# EAGLE design ft-joy (EAGLE 6.6.0)
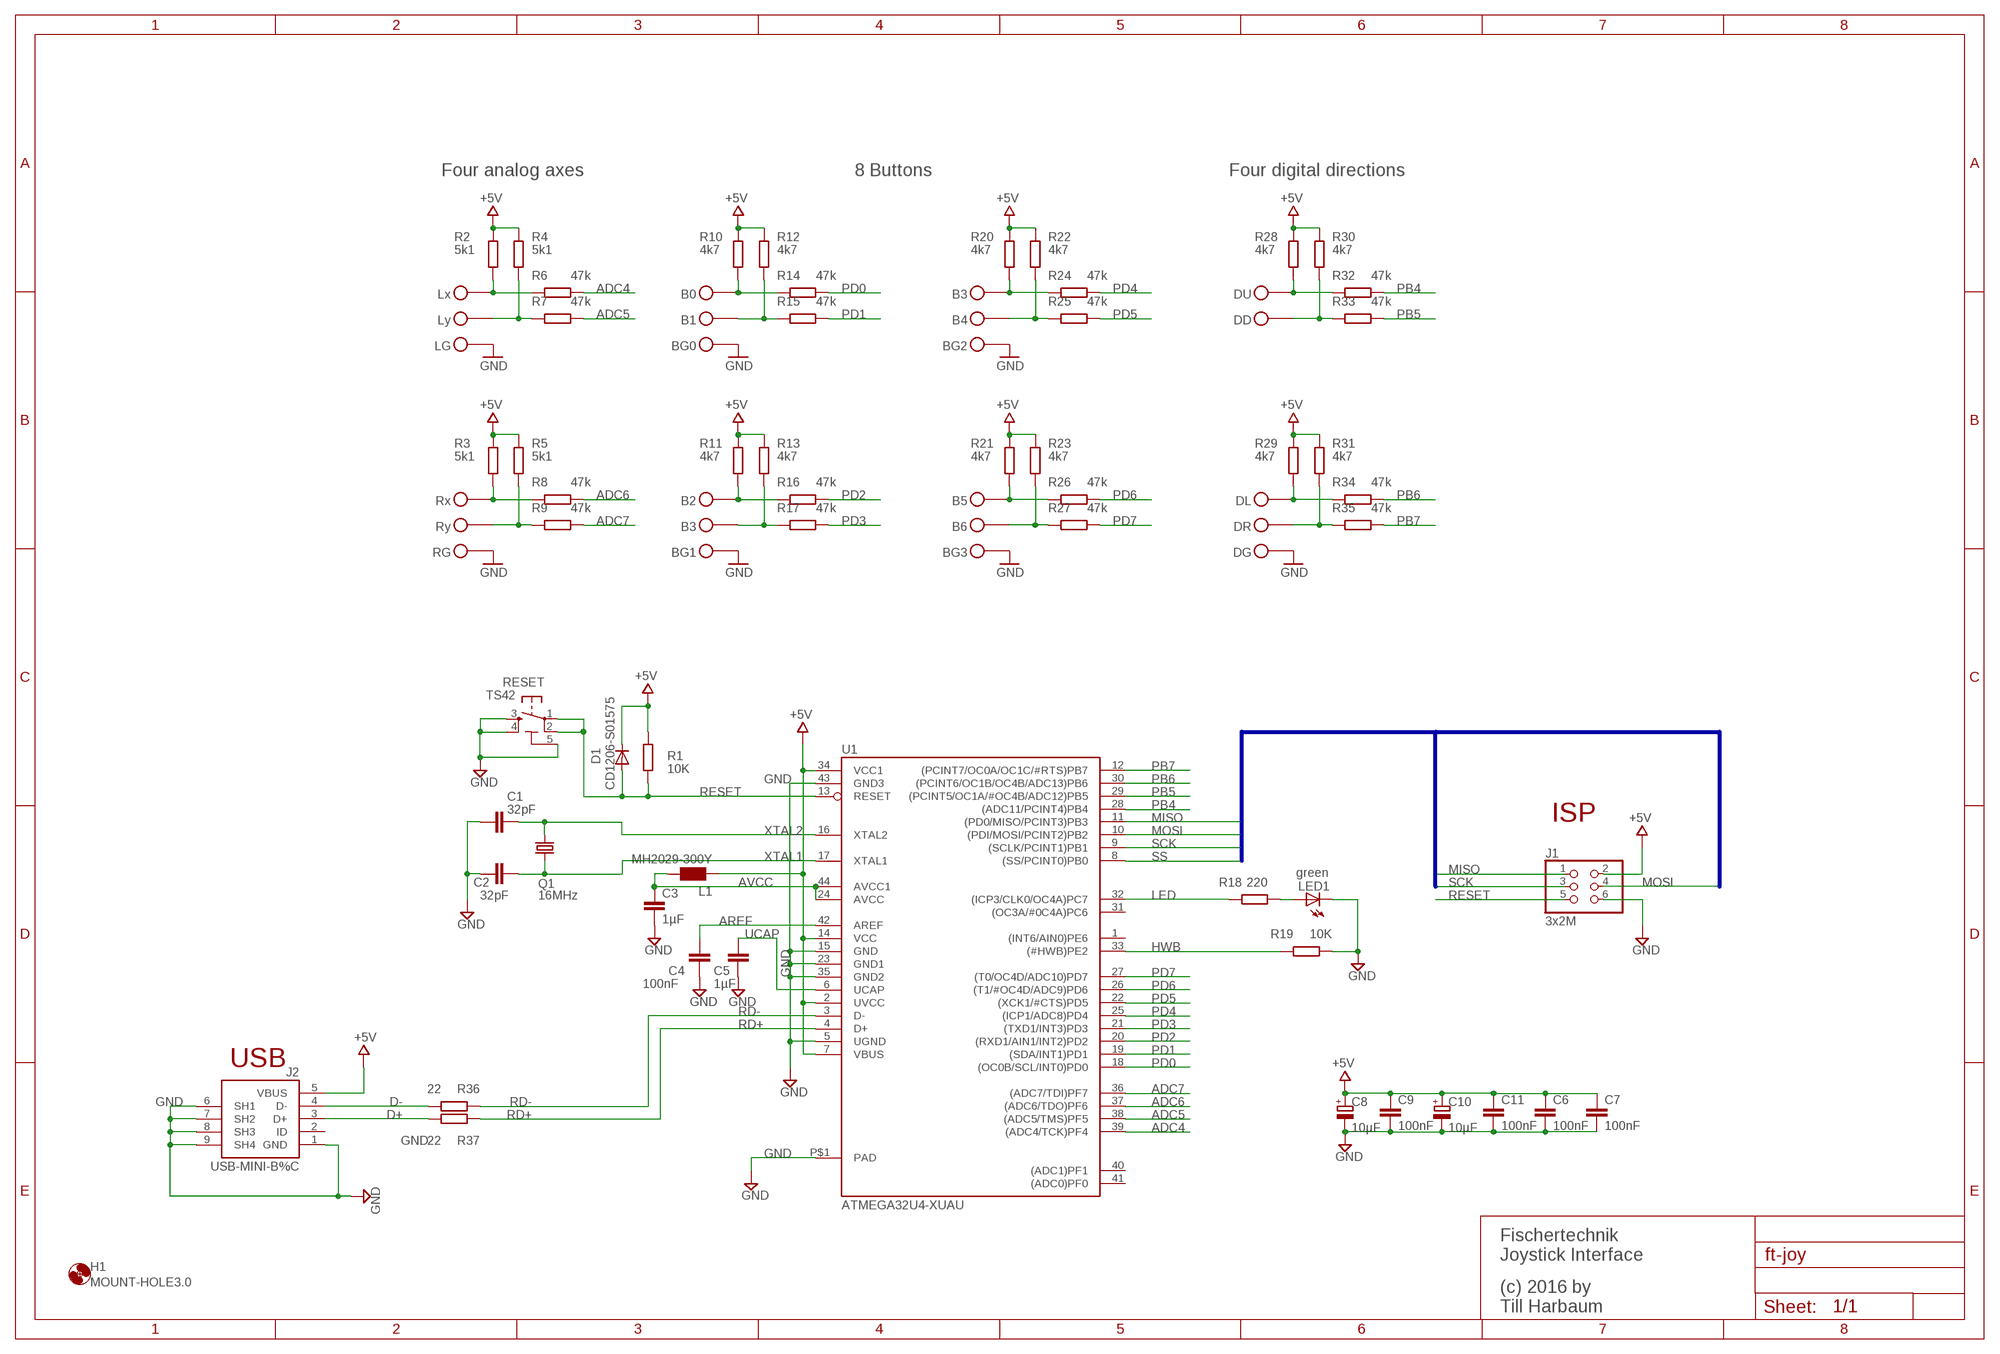
[diagram p0: schematic, sheet 1]

## Parts
C1  32pF  C-EUC0805  [C0805]
C2  32pF  C-EUC0805  [C0805]
C3  1µF  C-EUC0805  [C0805]
C4  100nF  C-EUC0805  [C0805]
C5  1µF  C-EUC0805  [C0805]
C6  100nF  C-EUC0805  [C0805]
C7  100nF  C-EUC0805  [C0805]
C8  10µF  CPOL-EUSMCB  [SMC_B]
C9  100nF  C-EUC0805  [C0805]
C10  10µF  CPOL-EUSMCB  [SMC_B]
C11  100nF  C-EUC0805  [C0805]
D1  CD1206-S01575  DIODE-MINIMELF  [MINIMELF]
H1  MOUNT-HOLE3.0  [3,0]
J1  3x2M  PINHD-2X3  [2X03]
J2  USB-MINI-B%C  [USB-MINI-B_2]
L1  MH2029-300Y  WE-CBF_0805  [0805]
LED1  green  LEDCHIPLED_0805  [CHIPLED_0805]
P1  Lx  FT-HUELSE  [FT-HUELSE]
P2  Ly  FT-HUELSE  [FT-HUELSE]
P3  LG  FT-HUELSE  [FT-HUELSE]
P4  Rx  FT-HUELSE  [FT-HUELSE]
P5  Ry  FT-HUELSE  [FT-HUELSE]
P6  RG  FT-HUELSE  [FT-HUELSE]
P7  B0  FT-HUELSE  [FT-HUELSE]
P8  B1  FT-HUELSE  [FT-HUELSE]
P9  BG0  FT-HUELSE  [FT-HUELSE]
P10  B2  FT-HUELSE  [FT-HUELSE]
P11  B3  FT-HUELSE  [FT-HUELSE]
P12  BG1  FT-HUELSE  [FT-HUELSE]
P13  B3  FT-HUELSE  [FT-HUELSE]
P14  B4  FT-HUELSE  [FT-HUELSE]
P15  BG2  FT-HUELSE  [FT-HUELSE]
P16  B5  FT-HUELSE  [FT-HUELSE]
P17  B6  FT-HUELSE  [FT-HUELSE]
P18  BG3  FT-HUELSE  [FT-HUELSE]
P19  DU  FT-HUELSE  [FT-HUELSE]
P20  DD  FT-HUELSE  [FT-HUELSE]
P21  DL  FT-HUELSE  [FT-HUELSE]
P22  DR  FT-HUELSE  [FT-HUELSE]
P23  DG  FT-HUELSE  [FT-HUELSE]
Q1  16MHz  CRYSTALHC49UP  [HC49UP]
R1  10K  R-EU_R0805  [R0805]
R2  5k1  R-EU_M0805  [M0805]
R3  5k1  R-EU_M0805  [M0805]
R4  5k1  R-EU_M0805  [M0805]
R5  5k1  R-EU_M0805  [M0805]
R6  47k  R-EU_M0805  [M0805]
R7  47k  R-EU_M0805  [M0805]
R8  47k  R-EU_M0805  [M0805]
R9  47k  R-EU_M0805  [M0805]
R10  4k7  R-EU_M0805  [M0805]
R11  4k7  R-EU_M0805  [M0805]
R12  4k7  R-EU_M0805  [M0805]
R13  4k7  R-EU_M0805  [M0805]
R14  47k  R-EU_M0805  [M0805]
R15  47k  R-EU_M0805  [M0805]
R16  47k  R-EU_M0805  [M0805]
R17  47k  R-EU_M0805  [M0805]
R18  220  R-EU_R0805  [R0805]
R19  10K  R-EU_R0805  [R0805]
R20  4k7  R-EU_M0805  [M0805]
R21  4k7  R-EU_M0805  [M0805]
R22  4k7  R-EU_M0805  [M0805]
R23  4k7  R-EU_M0805  [M0805]
R24  47k  R-EU_M0805  [M0805]
R25  47k  R-EU_M0805  [M0805]
R26  47k  R-EU_M0805  [M0805]
R27  47k  R-EU_M0805  [M0805]
R28  4k7  R-EU_M0805  [M0805]
R29  4k7  R-EU_M0805  [M0805]
R30  4k7  R-EU_M0805  [M0805]
R31  4k7  R-EU_M0805  [M0805]
R32  47k  R-EU_M0805  [M0805]
R33  47k  R-EU_M0805  [M0805]
R34  47k  R-EU_M0805  [M0805]
R35  47k  R-EU_M0805  [M0805]
R36  22  R-EU_M0805  [M0805]
R37  22  R-EU_M0805  [M0805]
RESET  TS42  [TS42]
U1  ATMEGA32U4-XUAU  [TQFP44-PAD]

## Nets
+5V: C6.1 C7.1 C8.+ C9.1 C10.+ C11.1 D1.C J1.2 J2.5(VBUS) L1.1 R1.1 R2.1 R3.1 R4.1 R5.1 R10.1 R11.1 R12.1 R13.1 R20.1 R21.1 R22.1 R23.1 R28.1 R29.1 R30.1 R31.1 U1.2(UVCC) U1.7(VBUS) U1.14(VCC) U1.34(VCC1)
ADC4: R6.1 U1.39((ADC4/TCK)PF4)
ADC5: R7.1 U1.38((ADC5/TMS)PF5)
ADC6: R8.1 U1.37((ADC6/TDO)PF6)
ADC7: R9.1 U1.36((ADC7/TDI)PF7)
AREF: C4.1 U1.42(AREF)
AVCC: C3.1 L1.2 U1.24(AVCC) U1.44(AVCC1)
D+: J2.3(D+) R37.1
D-: J2.4(D-) R36.1
GND: C1.1 C2.1 C3.2 C4.2 C5.2 C6.2 C7.2 C8.- C9.2 C10.- C11.2 J1.6 J2.1(GND) J2.6(SH1) J2.7(SH2) J2.8(SH3) J2.9(SH4) LED1.C P3.D1 P6.D1 P9.D1 P12.D1 P15.D1 P18.D1 P23.D1 R19.2 RESET.3 RESET.4 RESET.5(5-GND) U1.5(UGND) U1.15(GND) U1.23(GND1) U1.35(GND2) U1.43(GND3) U1.P$1(PAD)
HWB: R19.1 U1.33((#HWB)PE2)
LED: R18.1 U1.32((ICP3/CLK0/OC4A)PC7)
MISO: J1.1 U1.11((PD0/MISO/PCINT3)PB3)
MOSI: J1.4 U1.10((PDI/MOSI/PCINT2)PB2)
N$1: P2.D1 R4.2 R7.2
N$2: P4.D1 R3.2 R8.2
N$3: P5.D1 R5.2 R9.2
N$4: P7.D1 R10.2 R14.2
N$5: P8.D1 R12.2 R15.2
N$6: P10.D1 R11.2 R16.2
N$7: LED1.A R18.2
N$8: P11.D1 R13.2 R17.2
N$9: P13.D1 R20.2 R24.2
N$10: P14.D1 R22.2 R25.2
N$11: P16.D1 R21.2 R26.2
N$12: P17.D1 R23.2 R27.2
N$13: P19.D1 R28.2 R32.2
N$14: P20.D1 R30.2 R33.2
N$15: P21.D1 R29.2 R34.2
N$16: P22.D1 R31.2 R35.2
N$33: P1.D1 R2.2 R6.2
PB4: R32.1 U1.28((ADC11/PCINT4)PB4)
PB5: R33.1 U1.29((PCINT5/OC1A/#OC4B/ADC12)PB5)
PB6: R34.1 U1.30((PCINT6/OC1B/OC4B/ADC13)PB6)
PB7: R35.1 U1.12((PCINT7/OC0A/OC1C/#RTS)PB7)
PD0: R14.1 U1.18((OC0B/SCL/INT0)PD0)
PD1: R15.1 U1.19((SDA/INT1)PD1)
PD2: R16.1 U1.20((RXD1/AIN1/INT2)PD2)
PD3: R17.1 U1.21((TXD1/INT3)PD3)
PD4: R24.1 U1.25((ICP1/ADC8)PD4)
PD5: R25.1 U1.22((XCK1/#CTS)PD5)
PD6: R26.1 U1.26((T1/#OC4D/ADC9)PD6)
PD7: R27.1 U1.27((T0/OC4D/ADC10)PD7)
RD+: R37.2 U1.4(D+)
RD-: R36.2 U1.3(D-)
RESET: D1.A J1.5 R1.2 RESET.1 RESET.2 U1.13(RESET)
SCK: J1.3 U1.9((SCLK/PCINT1)PB1)
SS: U1.8((SS/PCINT0)PB0)
UCAP: C5.1 U1.6(UCAP)
XTAL1: C2.2 Q1.2 U1.17(XTAL1)
XTAL2: C1.2 Q1.1 U1.16(XTAL2)
Unconnected: J2.2(ID) U1.1((INT6/AIN0)PE6) U1.31((OC3A/#0C4A)PC6) U1.40((ADC1)PF1) U1.41((ADC0)PF0)

## Buses
B$1

## Notes on the sheet
- Four analog axes | 8 Buttons | Four digital directions
- ISP
- USB
- Fischertechnik
  Joystick Interface
- (c) 2016 by
  Till Harbaum

## Library data of the parts
C1-C7 C9 C11 = SmartPrj:C-EU: CAPACITOR, European symbol
C8 C10 = rcl:CPOL-EU: POLARIZED CAPACITOR, European symbol
D1 = diode:DIODE-: DIODE
H1 = holes:MOUNT-HOLE: MOUNTING HOLE with drill center marker
J1 = SmartPrj:PINHD-2X3: PIN HEADER
J2 = MyCON2:USB-MINI-B
L1 = wuerth-elektronik:WE-CBF: SMD EMI Suppression Ferrite Beads - excellent anti-EMI properties - low DCR - impedances till 3000 ohms - rated current up to 6 A
LED1 = led:LED: LED OSRAM: - CHIPLED LG R971, LG N971, LY N971, LG Q971, LY Q971, LO R971, LY R971 LH N974, LH R974 LS Q976, LO Q976, LY Q976 LO Q996 - Hyper CHIPLED LW Q18S LB Q993, LB Q99A, LB R99A - SideLED LS A670, LO A670, LY A670, LG A670, LP A670 LB A673, LV A673, LT A673, LW A673 LH A674 LY A675 LS A676, LA A676, LO A676, LY A676, LW A676 LS A679, LY A679, LG A679 - Hyper Micro SIDELED® LS Y876, LA Y876, LO Y876, LY Y876 LT Y87S - SmartLED LW L88C, LW L88S LB L89C, LB L89S, LG L890 LS L89K, LO L89K, LY L89K LS L896, LA L896, LO L896, LY L896 - TOPLED LS T670, LO T670, LY T670, LG T670, LP T670 LSG T670, LSP T670, LSY T670, LOP T670, LYG T670 LG T671, LOG T671, LSG T671 LB T673, LV T673, LT T673, LW T673 LH T674 LS T676, LA T676, LO T676, LY T676, LB T676, LH T676, LSB T676, LW T676 LB T67C, LV T67C, LT T67C, LS T67K, LO T67K, LY T67K, LW E67C LS E67B, LA E67B, LO E67B, LY E67B, LB E67C, LV E67C, LT E67C LW T67C LS T679, LY T679, LG T679 LS T770, LO T770, LY T770, LG T770, LP T770 LB T773, LV T773, LT T773, LW T773 LH T774 LS E675, LA E675, LY E675, LS T675 LS T776, LA T776, LO T776, LY T776, LB T776 LHGB T686 LT T68C, LB T68C - Hyper Mini TOPLED® LB M676 - Mini TOPLED Santana® LG M470 LS M47K, LO M47K, LY M47K Source: http://www.osram.convergy.de LUXEON: - LUMILED® LXK2-PW12-R00, LXK2-PW12-S00, LXK2-PW14-U00, LXK2-PW14-V00 LXK2-PM12-R00, LXK2-PM12-S00, LXK2-PM14-U00 LXK2-PE12-Q00, LXK2-PE12-R00, LXK2-PE12-S00, LXK2-PE14-T00, LXK2-PE14-U00 LXK2-PB12-K00, LXK2-PB12-L00, LXK2-PB12-M00, LXK2-PB14-N00, LXK2-PB14-P00, LXK2-PB14-Q00 LXK2-PR12-L00, LXK2-PR12-M00, LXK2-PR14-Q00, LXK2-PR14-R00 LXK2-PD12-Q00, LXK2-PD12-R00, LXK2-PD12-S00 LXK2-PH12-R00, LXK2-PH12-S00 LXK2-PL12-P00, LXK2-PL12-Q00, LXK2-PL12-R00 Source: www.luxeon.com KINGBRIGHT: KA-3528ASYC Source: www.kingbright.com
P1-P23 = ft-huelse:FT-HUELSE
Q1 = crystal:CRYSTAL: CRYSTAL; OC_FARNELL: unknown; OC_NEWARK: unknown
R1 R18 R19 = SmartPrj:R-EU_: RESISTOR, European symbol
R2-R17 R20-R37 = resistor:R-EU_: RESISTOR, European symbol
RESET = SmartPrj:TS42: TS42 Dongnan Electronics Tact switch VDC 12V - 50mA
U1 = SmartPrj:ATMEGA32U4-XU

## Net classes
0 default: width 0.254 mm, drill 0.508 mm, clearance 0.203 mm

## Board
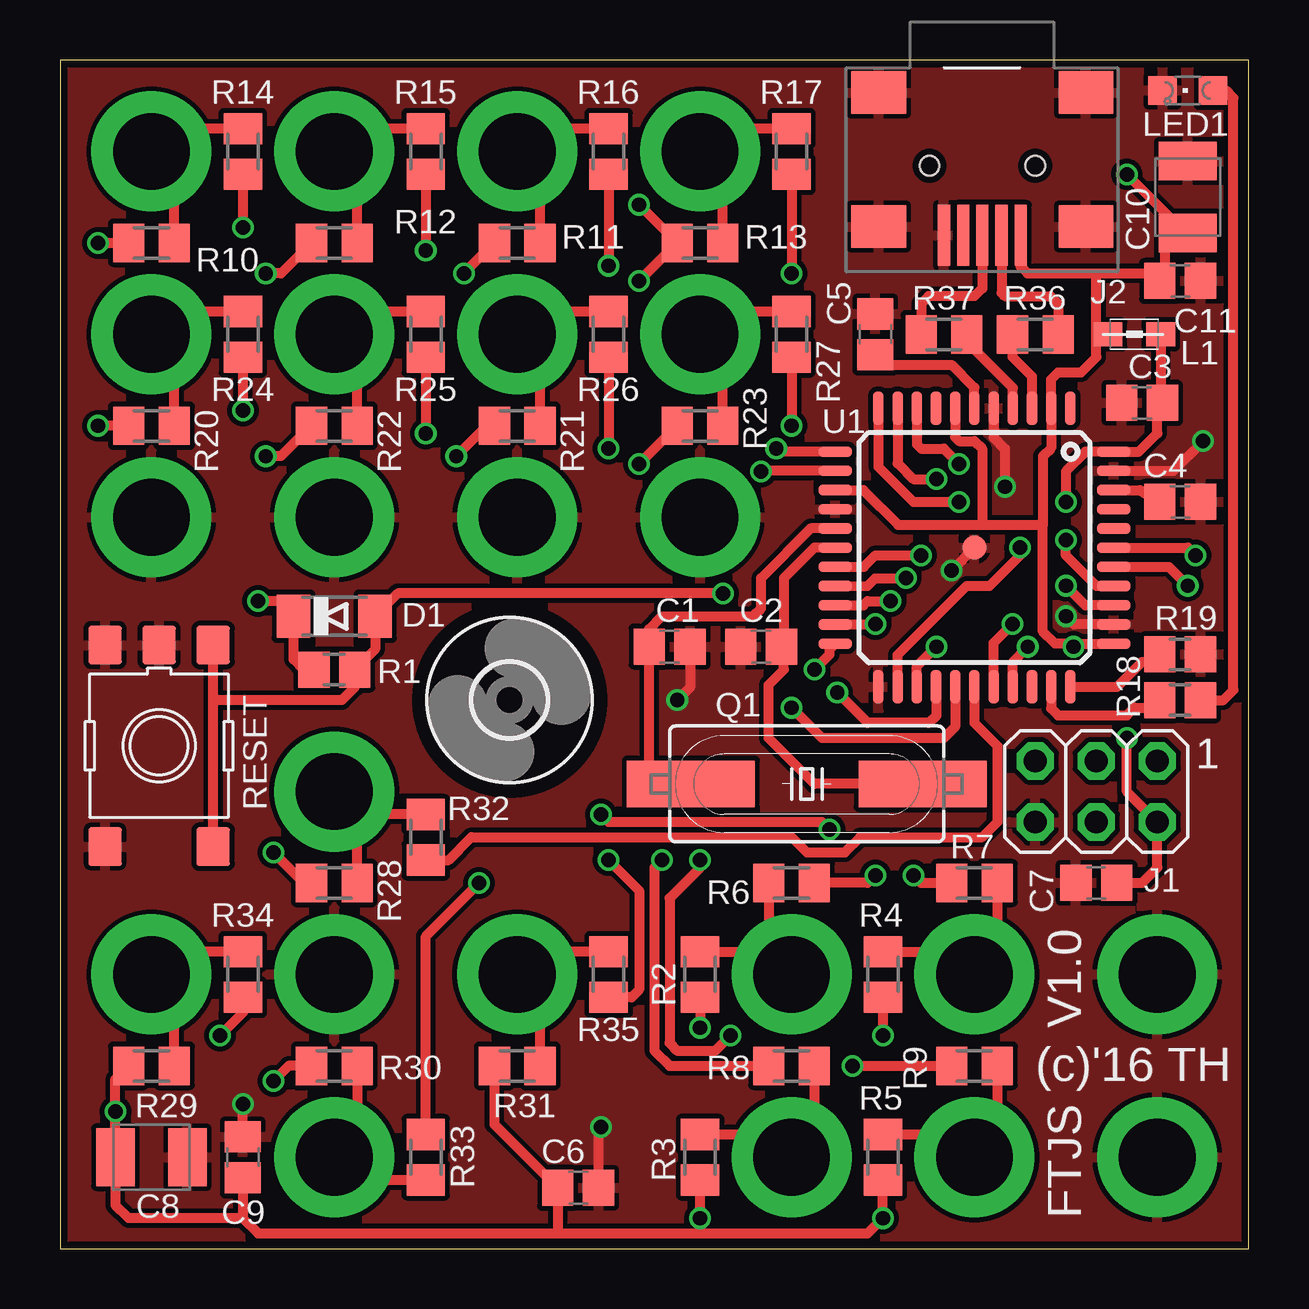
[diagram p1: board, top side]
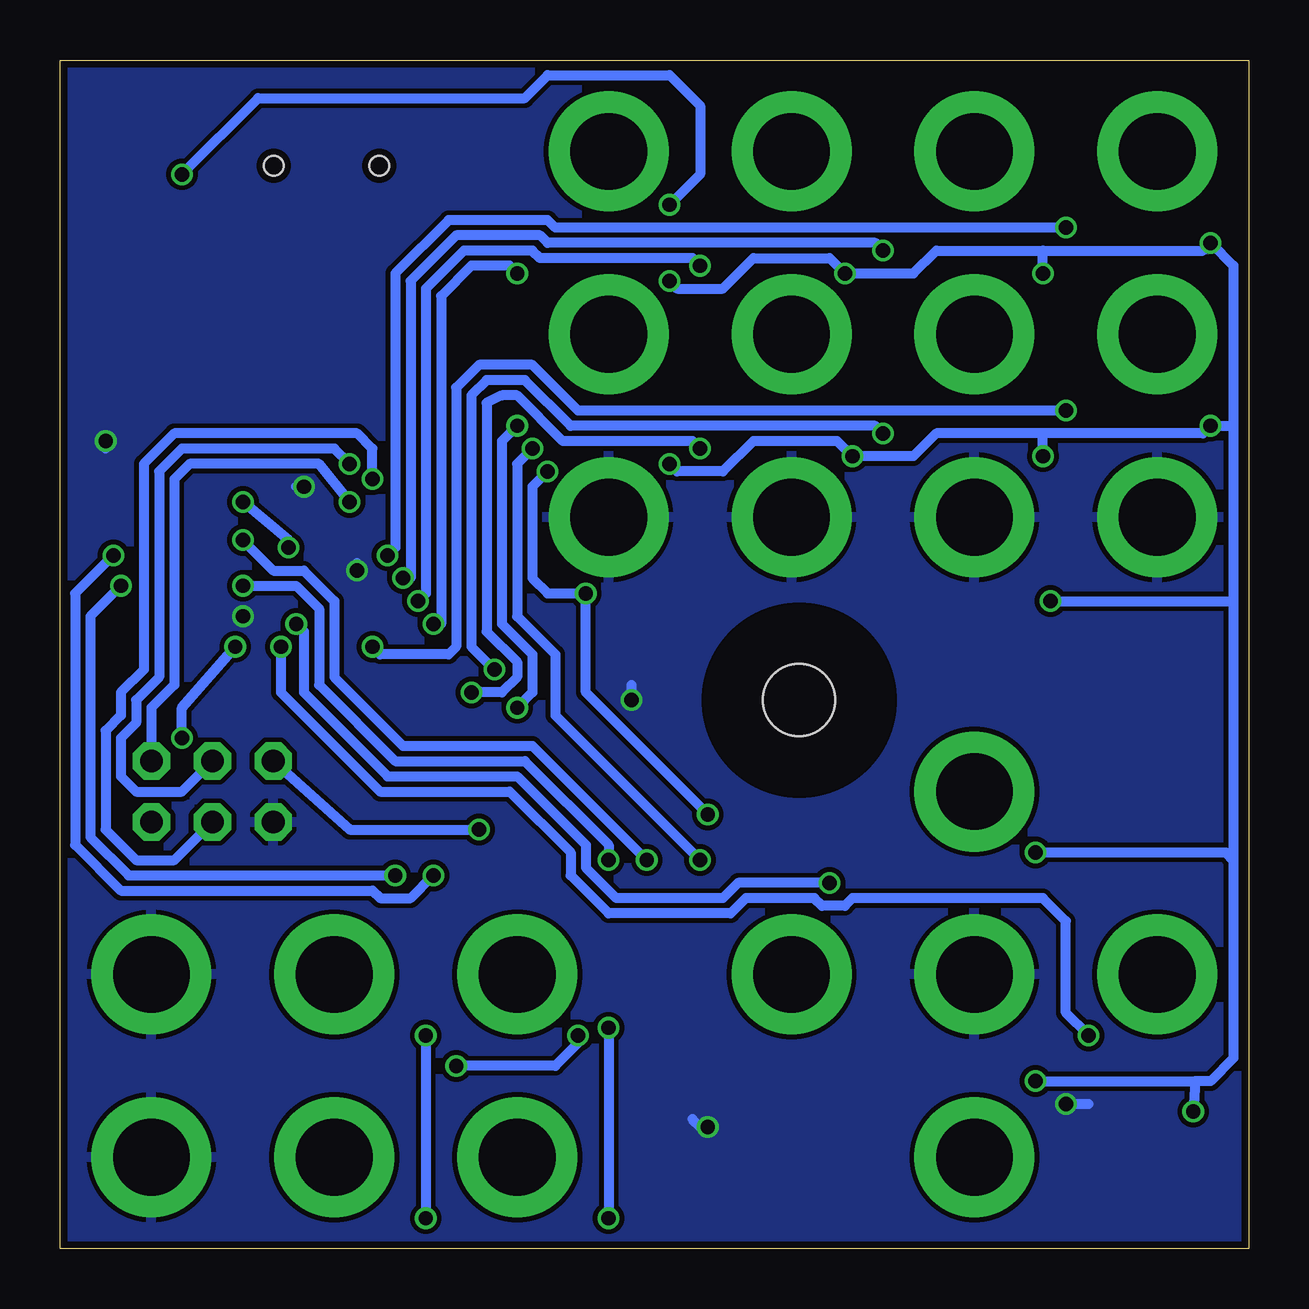
[diagram p2: board, bottom side, seen from below]

Size 49.53 x 49.53 mm. Coordinates in mm from the lower left corner, seen from the top.
Outline: 0,0 49.53,0 49.53,49.53 0,49.53 0,0
Copper layers (1*16): Top 0.035mm / dielectric 1.5mm / Bottom 0.035mm
Design rules "PCB-POOL Standard": minimum track width 0.15mm, minimum drill 0.3mm, track to track 0.15mm, track to pad 0.15mm, pad to pad 0.15mm, via to via 0.15mm, smd to smd 0.15mm, copper to edge 0.3mm, drill to drill 0.2mm, minimum pad ring 0.2mm, minimum via ring 0.15mm, stop-mask expansion 0.075mm, vias tented up to drill 0mil, thermal gap 0.2mm

### Footprints (pad centres in the part's own frame; a part is rotated, then mirrored left to right if it is on the bottom)
C0805 = smd 1.3 x 1.5: 1 -0.85,0; 2 0.85,0
SMC_B = smd 1.6 x 2.4: + -1.5,0; - 1.5,0
MINIMELF = smd 1.4 x 1.8: A 1.7,0; C -1.7,0
3,0 = hole 3: 0,0
2X03 = drill 0.95 pad 1.55 octagon: 1 -2.54,-1.27; 2 -2.54,1.27; 3 0,-1.27; 4 0,1.27; 5 2.54,-1.27; 6 2.54,1.27
USB-MINI-B_2 = smd 0.508 x 2.54: 1 0,0; 2 0.8,0; 3 1.6,0; 4 2.4,0; 5 3.2,0 | smd 2.286 x 1.778: 6 -2.717,5.948; 7 -2.717,0.36; 8 5.918,0.36; 9 5.918,5.948 | hole 0.813: -0.6,2.9; 3.8,2.9
0805 = smd 1.2 x 1: 1 -1.1,0; 2 1.1,0
CHIPLED_0805 = smd 1.2 x 1.2: A 0,-1.05; C 0,1.05
FT-HUELSE = drill 3.2 pad 5: D1 0,0
HC49UP = smd 5.334 x 1.93: 1 -4.826,0; 2 4.826,0
R0805 = smd 1.3 x 1.5: 1 -0.85,0; 2 0.85,0
M0805 = smd 1.3 x 1.6: 1 -0.95,0; 2 0.95,0
TS42 = smd 1.6 x 1.4: 1 -4.2,2.25; 2 4.2,2.25; 3 -4.2,-2.25; 4 4.2,-2.25; 5 -4.2,0
TQFP44-PAD = smd 1.4 x 0.45: 1 -5.8,4; 2 -5.8,3.2; 3 -5.8,2.4; 4 -5.8,1.6; 5 -5.8,0.8; 6 -5.8,0; 7 -5.8,-0.8; 8 -5.8,-1.6; 9 -5.8,-2.4; 10 -5.8,-3.2; 11 -5.8,-4; 23 5.8,-4; 24 5.8,-3.2; 25 5.8,-2.4; 26 5.8,-1.6; 27 5.8,-0.8; 28 5.8,0; 29 5.8,0.8; 30 5.8,1.6; 31 5.8,2.4; 32 5.8,3.2; 33 5.8,4 | smd 0.45 x 1.4: 12 -4,-5.8; 13 -3.2,-5.8; 14 -2.4,-5.8; 15 -1.6,-5.8; 16 -0.8,-5.8; 17 0,-5.8; 18 0.8,-5.8; 19 1.6,-5.8; 20 2.4,-5.8; 21 3.2,-5.8; 22 4,-5.8; 34 4,5.8; 35 3.2,5.8; 36 2.4,5.8; 37 1.6,5.8; 38 0.8,5.8; 39 0,5.8; 40 -0.8,5.8; 41 -1.6,5.8; 42 -2.4,5.8; 43 -3.2,5.8; 44 -4,5.8 | smd 1 x 1: P$1 0,0

### Placement (x,y rotation side)
C1  25.4,25.08 180 top
C2  29.21,25.08 0 top
C3  45.09,35.24 180 top
C4  46.67,31.11 0 top
C5  33.97,38.1 90 top
C6  21.59,2.54 0 top
C7  43.18,15.24 180 top
C8  3.81,3.81 0 top
C9  7.62,3.81 90 top
C10  46.99,43.81 90 top
C11  46.67,40.32 0 top
D1  11.43,26.35 0 top
H1  18.73,22.86 0 top
J1  43.18,19.05 180 top
J2  36.83,42.23 0 top
L1  44.77,38.1 0 top
LED1  46.99,48.26 90 top
P1  30.48,11.43 0 top
P2  38.1,11.43 0 top
P3  45.72,11.43 0 top
P4  30.48,3.81 0 top
P5  38.1,3.81 0 top
P6  45.72,3.81 0 top
P7  3.81,45.72 0 top
P8  11.43,45.72 0 top
P9  3.81,30.48 0 top
P10  19.05,45.72 0 top
P11  26.67,45.72 0 top
P12  11.43,30.48 0 top
P13  3.81,38.1 0 top
P14  11.43,38.1 0 top
P15  19.05,30.48 0 top
P16  19.05,38.1 0 top
P17  26.67,38.1 0 top
P18  26.67,30.48 0 top
P19  11.43,19.05 0 top
P20  11.43,3.81 0 top
P21  3.81,11.43 0 top
P22  19.05,11.43 0 top
P23  11.43,11.43 0 top
Q1  31.11,19.37 0 top
R1  11.43,24.13 0 top
R2  26.67,11.43 90 top
R3  26.67,3.81 90 top
R4  34.29,11.43 90 top
R5  34.29,3.81 90 top
R6  30.48,15.24 180 top
R7  38.1,15.24 0 top
R8  30.48,7.62 0 top
R9  38.1,7.62 0 top
R10  3.81,41.91 0 top
R11  19.05,41.91 0 top
R12  11.43,41.91 0 top
R13  26.67,41.91 0 top
R14  7.62,45.72 90 top
R15  15.24,45.72 90 top
R16  22.86,45.72 90 top
R17  30.48,45.72 90 top
R18  46.67,22.86 0 top
R19  46.67,24.77 0 top
R20  3.81,34.29 0 top
R21  19.05,34.29 0 top
R22  11.43,34.29 0 top
R23  26.67,34.29 0 top
R24  7.62,38.1 90 top
R25  15.24,38.1 90 top
R26  22.86,38.1 90 top
R27  30.48,38.1 90 top
R28  11.43,15.24 0 top
R29  3.81,7.62 0 top
R30  11.43,7.62 0 top
R31  19.05,7.62 0 top
R32  15.24,17.14 90 top
R33  15.24,3.81 270 top
R34  7.62,11.43 90 top
R35  22.86,11.43 90 top
R36  40.64,38.1 180 top
R37  36.83,38.1 0 top
RESET  4.13,20.95 270 top
U1  38.1,29.21 270 top

### Tracks (layer width: path | path; a pad name or v marks a point on that pad's centre or on a via)
+5V  (via drill 0.6)
  Top 0.406: R29.1 2.31,7.07 v2.31,5.71 C8.+ 2.31,1.82 2.86,1.27 7.62,1.27 | v24.13,40.32 R13.1 v24.13,43.5 | v1.59,41.91 R10.1 | R12.1 9.21,40.64 v8.57,40.64 | R11.1 v16.83,40.64 | R20.1 v1.59,34.29 | v24.13,32.7 R23.1 | R21.1 17.78,34.29 v16.51,33.02 | R22.1 10.16,33.98 9.21,33.02 v8.57,33.02 | C9.1 7.62,1.27 | 7.62,1.27 8.26,0.64 20.64,0.64 | 20.64,0.64 26.67,0.64 | 26.67,0.64 33.66,0.64 v34.29,1.27 R5.1 | 26.67,0.64 v26.67,1.27 R3.1 | R30.1 9.53,7.62 v8.89,6.99 | R1.1 10.16,24.13 9.73,24.56 D1.C 9.84,26.24 9.21,26.99 v8.26,26.99 | R31.1 18.1,7.3 18.1,5.18 C6.1 20.74,0.74 20.64,0.64 | R4.1 v34.29,8.89 | R2.1 v26.67,9.21 | R28.1 10.16,15.24 v8.89,16.51 | J2.5 40.03,40.93 40.32,40.64 43.18,40.64 | 43.18,40.64 46.04,40.64 46.14,40.54 C11.1 46.04,40.54 46.04,42.23 46.46,42.51 46.9,42.31 | U1.14 33.48,31.61 34.92,30.16 38.42,30.16 | 38.42,30.16 40.96,30.16 | 42.23,25.21 41.47,25.21 40.96,25.72 40.96,30.16 | 43.18,38.1 43.18,37.15 42.55,36.51 41.59,36.51 41.3,36.22 U1.2 41.3,33.36 40.96,33.02 40.96,30.16 | 43.18,38.1 43.18,40.64 | L1.1 43.18,38.1 | C7.1 45.09,15.24 45.72,15.88 J1.2 44.45,19.05 v44.45,21.27 | v42.23,25.08 42.23,25.21 | 42.23,25.21 U1.34 | v44.45,44.77 46.9,42.31 | 46.9,42.31 C10.+ | U1.7 37.3,33.82 37.47,33.66 38.1,33.66 38.42,33.34 38.42,30.16
  Bottom 0.406: v24.13,40.32 23.81,40.01 21.91,40.01 20.64,41.27 17.46,41.27 v16.83,40.64 13.97,40.64 13.02,41.59 8.57,41.59 | 8.57,41.59 1.91,41.59 v1.59,41.91 0.64,40.96 0.64,34.29 | v8.57,40.64 8.57,41.59 | 8.57,33.97 1.91,33.97 v1.59,34.29 0.64,34.29 | 8.57,33.97 13.02,33.97 13.97,33.02 v16.51,33.02 17.14,33.66 20.64,33.66 21.91,32.38 23.81,32.38 v24.13,32.7 | v8.57,33.02 8.57,33.97 | v8.89,6.99 2.22,6.99 | 2.22,6.99 v2.31,5.71 | 0.64,34.29 0.64,26.99 | 0.64,26.99 0.64,16.19 | 0.64,16.19 0.64,7.94 1.59,6.99 2.22,6.99 | v8.26,26.99 0.64,26.99 | v34.29,8.89 v34.29,1.27 | v26.67,9.21 v26.67,1.27 | v8.89,16.51 0.95,16.51 0.64,16.19 | v44.45,44.77 41.27,47.94 30.16,47.94 29.21,48.9 24.13,48.9 22.86,47.62 22.86,44.77 v24.13,43.5 | v44.45,21.27 44.45,22.54 v42.23,25.08
ADC4  (via drill 0.6)
  Top 0.406: U1.39 46.99,29.21 v47.31,28.89 | v33.97,15.56 33.66,15.24 R6.1
  Bottom 0.406: v47.31,28.89 48.9,27.3 48.9,16.83 46.99,14.92 36.51,14.92 36.2,14.61 34.92,14.61 v33.97,15.56
ADC5  (via drill 0.6)
  Top 0.406: U1.38 46.2,28.41 v46.99,27.62 | v35.56,15.56 35.88,15.24 R7.1
  Bottom 0.406: v46.99,27.62 48.26,26.35 48.26,17.14 46.67,15.56 v35.56,15.56
ADC6  (via drill 0.6)
  Top 0.406: U1.37 43.19,27.61 41.91,28.89 v41.91,29.53 | v25.08,16.19 24.77,15.88 24.77,8.26 25.4,7.62 R8.1
  Bottom 0.406: v41.91,29.53 40.64,28.26 39.37,28.26 38.1,26.99 38.1,23.81 35.24,20.95 29.84,20.95 v25.08,16.19
ADC7  (via drill 0.6)
  Top 0.406: U1.36 42.72,26.81 v41.91,27.62 | v26.67,16.19 26.67,15.88 25.4,14.61 25.4,8.57 25.72,8.26 27.3,8.26 v27.94,8.89 | v33.02,7.62 R9.1
  Bottom 0.406: v41.91,27.62 39.69,27.62 38.73,26.67 38.73,23.5 35.56,20.32 30.16,20.32 26.67,16.83 v26.67,16.19 | v27.94,8.89 27.94,8.57 28.89,7.62 v33.02,7.62
AREF
  Top 0.406: U1.42 45.01,31.61 C4.1
AVCC  (via drill 0.6)
  Top 0.406: L1.2 45.87,35.31 C3.1 45.72,35.03 45.72,33.97 44.96,33.21 U1.44 42.73,33.21 41.91,32.38 v41.91,31.11 | U1.24 34.9,24.74 37.78,27.62 38.73,27.62 40.01,28.89 v40.01,29.21
  Bottom 0.406: v40.01,29.21 40.01,29.53 v41.91,31.11
D+
  Top 0.406: J2.3 38.43,40.02 38.1,39.69 36.2,39.69 35.88,39.37 R37.1
D-
  Top 0.406: J2.4 39.23,39.83 39.37,39.69 41.27,39.69 41.59,39.37 R36.1
GND  (via drill 0.6)
  Top 0.406: C1.1 26.25,23.39 v25.72,22.86 | U1.43 46.38,32.41 v47.62,33.66 | U1.35 42.25,26.01 v41.91,26.35 | C6.2 22.44,4.98 v22.54,5.08 | C9.2 v7.62,6.03 | U1.5 38.9,33.81 39.37,33.34 v39.37,31.75 | U1.P$1 v37.15,28.26
  Bottom 0.406: v25.72,22.86 25.72,23.5 | v39.37,31.75 39.69,31.75 | v47.62,33.66 47.62,33.34 | v22.54,5.08 22.86,5.08 23.18,5.4 | v7.62,6.03 6.67,6.03 | v37.15,28.26 37.15,28.57
  pour Top: 0,0 0,49.53 49.53,49.53 49.53,0
  pour Bottom: 0,0 0,49.53 49.53,49.53 49.53,0
HWB
  Top 0.406: U1.33 44.05,23.41 45.09,24.45 45.72,24.45 R19.1
LED
  Top 0.406: U1.32 41.3,22.52 41.59,22.23 44.45,22.23 44.77,22.54 45.3,22.54 R18.1
MISO  (via drill 0.6)
  Top 0.406: U1.11 34.1,32.58 35.56,31.11 v37.47,31.11
  Bottom 0.406: v37.47,31.11 38.73,32.7 44.13,32.7 44.77,32.07 44.77,23.5 45.72,22.54 J1.1
MOSI  (via drill 0.6)
  Top 0.406: U1.10 34.9,32.73 35.56,32.07 v36.51,32.07
  Bottom 0.406: v36.51,32.07 36.51,33.34 37.15,33.97 44.77,33.97 46.04,32.7 46.04,24.13 46.99,23.18 46.99,22.23 47.62,21.59 47.62,17.46 46.35,16.19 44.77,16.19 J1.4
N$1
  Top 0.406: R7.2 39.05,12.38 P2.D1 37.15,12.38 R4.2
N$2
  Top 0.406: R3.2 29.53,4.76 P4.D1 31.43,4.76 R8.2
N$3
  Top 0.406: R9.2 39.05,4.76 P5.D1 37.15,4.76 R5.2
N$4
  Top 0.406: R10.2 4.76,44.77 P7.D1 4.76,46.67 R14.2
N$5
  Top 0.406: R15.2 12.38,46.67 P8.D1 12.38,44.77 R12.2
N$6
  Top 0.406: R16.2 20,46.67 P10.D1 20,44.77 R11.2
N$7
  Top 0.406: 47.31,22.86 R18.2 47.62,22.86 48.48,22.86 48.9,23.28 48.9,47.94 48.58,48.26 LED1.A
N$8
  Top 0.406: R17.2 27.62,46.67 P11.D1 27.62,44.77 R13.2
N$9
  Top 0.406: R20.2 4.76,37.15 P13.D1 4.76,39.05 R24.2
N$10
  Top 0.406: R25.2 12.38,39.05 P14.D1 12.38,37.15 R22.2
N$11
  Top 0.406: R26.2 20,39.05 P16.D1 20,37.15 R21.2
N$12
  Top 0.406: R27.2 27.62,39.05 P17.D1 27.62,37.15 R23.2
N$13
  Top 0.406: R32.2 12.7,18.09 P19.D1 12.38,18.1 R28.2
N$14
  Top 0.406: R33.2 12.38,2.85 | R30.2 12.38,2.85 | 12.38,2.85 P20.D1
N$15
  Top 0.406: R34.2 4.76,12.38 P21.D1 4.76,10.48 R29.2
N$16
  Top 0.406: R35.2 20,12.38 P22.D1 20,10.48 R31.2
N$33
  Top 0.406: R2.2 29.52,12.38 | 29.52,12.38 29.53,12.38 P1.D1 29.52,12.38 | R6.2 29.52,12.38
PB4
  Top 0.406: R32.1 16.2,16.2 17.14,17.14 30.48,17.14 31.11,16.51 32.7,16.51 33.34,17.14 38.42,17.14 39.05,17.78 39.05,20.95 38.1,21.91 U1.28
PB5  (via drill 0.6)
  Top 0.406: R33.1 15.24,13.02 v17.46,15.24 | U1.29 38.9,25.25 v39.69,26.04
  Bottom 0.406: v17.46,15.24 21.27,15.24 21.91,14.61 26.35,14.61 27.62,15.88 27.62,16.83 30.48,19.68 35.88,19.68 39.37,23.18 39.37,25.72 v39.69,26.04
PB6  (via drill 0.6)
  Top 0.406: R34.1 7.62,9.84 v6.67,8.89 | U1.30 39.7,24.43 v40.32,25.08
  Bottom 0.406: v6.67,8.89 7.62,9.84 7.62,13.65 8.57,14.61 16.51,14.61 16.83,14.29 17.78,14.29 18.1,14.61 20.95,14.61 21.59,13.97 26.67,13.97 28.26,15.56 28.26,16.51 30.8,19.05 36.2,19.05 40.32,23.18 v40.32,25.08
PB7  (via drill 0.6)
  Top 0.406: v22.86,16.19 24.13,14.92 24.13,10.79 23.81,10.48 R35.1 | U1.12 29.97,33.21 v29.84,33.34
  Bottom 0.406: v29.84,33.34 30.48,32.7 30.48,26.35 28.89,24.77 28.89,22.23 v22.86,16.19
PD0  (via drill 0.6)
  Top 0.406: R14.1 v7.62,42.55 | U1.18 33.49,28.41 33.97,28.89 v35.88,28.89
  Bottom 0.406: v7.62,42.55 28.89,42.55 29.21,42.86 33.34,42.86 35.56,40.64 35.56,29.21 v35.88,28.89
PD1  (via drill 0.6)
  Top 0.406: R15.1 v15.24,41.59 | U1.19 33.66,27.62 33.96,27.93 v35.24,27.94
  Bottom 0.406: v15.24,41.59 15.56,41.91 29.21,41.91 29.53,42.23 33.02,42.23 34.92,40.32 34.92,27.94 v35.24,27.94
PD2  (via drill 0.6)
  Top 0.406: R16.1 v22.86,40.96 | U1.20 33.48,26.81 33.66,26.99 v34.61,26.99
  Bottom 0.406: v22.86,40.96 23.18,41.27 29.53,41.27 29.84,41.59 32.7,41.59 34.29,40.01 34.29,27.3 v34.61,26.99
PD3  (via drill 0.6)
  Top 0.406: R17.1 v30.48,40.64 | U1.21 33.68,26.01 v33.97,26.04
  Bottom 0.406: v30.48,40.64 30.8,40.96 32.38,40.96 33.66,39.69 33.66,26.04 v33.97,26.04
PD4  (via drill 0.6)
  Top 0.406: R24.1 v7.62,34.92 | U1.25 35.7,24.27 v36.51,25.08
  Bottom 0.406: v7.62,34.92 27.94,34.92 29.84,36.83 32.07,36.83 33.02,35.88 33.02,25.08 33.34,24.77 36.2,24.77 v36.51,25.08
PD5  (via drill 0.6)
  Top 0.406: R25.1 v15.24,33.97 | v31.43,24.13 32.07,24.77 32.07,24.98 U1.22
  Bottom 0.406: v15.24,33.97 15.56,34.29 28.26,34.29 30.16,36.2 31.75,36.2 32.38,35.56 32.38,25.08 v31.43,24.13
PD6  (via drill 0.6)
  Top 0.406: R26.1 v22.86,33.34 | U1.26 36.5,22.21 | 36.5,22.21 36.51,22.23 | 36.5,22.21 36.2,21.91 33.66,21.91 v32.38,23.18
  Bottom 0.406: v22.86,33.34 23.18,33.66 28.57,33.66 30.48,35.56 31.11,35.56 31.75,35.24 31.75,25.72 30.48,24.45 30.48,23.81 31.11,23.18 v32.38,23.18
PD7  (via drill 0.6)
  Top 0.406: R27.1 v30.48,34.29 | U1.27 37.3,21.74 36.83,21.27 31.75,21.27 v30.48,22.54
  Bottom 0.406: v30.48,34.29 31.11,33.66 31.11,26.04 29.84,24.77 29.84,23.18 v30.48,22.54
RD+
  Top 0.406: U1.4 39.7,35.87 37.78,37.78 R37.2
RD-
  Top 0.406: U1.3 40.5,36.34 39.69,37.15 R36.2
RESET  (via drill 0.6)
  Top 0.406: RESET.2 6.38,22.86 | 6.38,22.86 RESET.1 | 6.38,22.86 11.75,22.86 12.28,23.39 R1.2 13.13,24.98 D1.A 14.08,27.3 v27.62,27.3 | U1.13 29.23,32.41 v29.21,32.38 | v32.07,17.46 31.75,17.78 22.86,17.78 v22.54,18.1
  Bottom 0.406: v29.21,32.38 29.84,31.75 29.84,27.94 29.21,27.3 v27.62,27.3 27.62,23.18 v22.54,18.1 | J1.5 37.47,17.46 v32.07,17.46
SCK  (via drill 0.6)
  Top 0.406: U1.9 35.7,33.52 35.88,33.34 36.83,33.34 v37.47,32.7
  Bottom 0.406: v37.47,32.7 38.1,33.34 44.45,33.34 45.4,32.38 45.4,23.81 46.35,22.86 46.35,21.91 46.99,21.27 46.99,19.68 46.35,19.05 44.45,19.05 J1.3
UCAP
  Top 0.406: C5.1 34.19,37.25 34.61,36.83 37.15,36.83 38.1,35.88 U1.6
XTAL1
  Top 0.406: Q1.2 31.43,19.37 29.53,21.27 29.53,23.5 30.16,24.13 30.16,24.98 C2.2 30.16,25.18 30.16,27.94 31.43,29.21 U1.17
XTAL2
  Top 0.406: Q1.1 24.55,19.37 C1.2 24.55,25.82 25.08,26.35 28.89,26.35 29.21,26.67 29.21,27.94 31.28,30.01 U1.16

### Text on the board
tPlace: V1.0 | (c)'16 TH | FTJS
tNames: 1